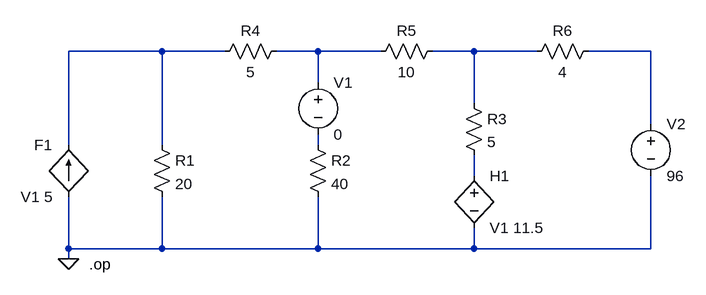
[diagram p0: schematic CH03-KP2-15.asc]
CH03-KP2-15.asc, the LTspice schematic file:
Version 4
SHEET 1 880 680
WIRE -16 208 -160 208
WIRE 80 208 -16 208
WIRE 224 208 160 208
WIRE 320 208 224 208
WIRE 464 208 400 208
WIRE 560 208 464 208
WIRE 736 208 640 208
WIRE 224 256 224 208
WIRE 464 288 464 208
WIRE 736 320 736 208
WIRE -160 352 -160 208
WIRE -16 352 -16 208
WIRE 224 352 224 336
WIRE 464 400 464 368
WIRE -160 512 -160 432
WIRE -16 512 -16 432
WIRE -16 512 -160 512
WIRE 224 512 224 432
WIRE 224 512 -16 512
WIRE 464 512 464 480
WIRE 464 512 224 512
WIRE 736 512 736 400
WIRE 736 512 464 512
WIRE -160 528 -160 512
FLAG -160 528 0
DATAFLAG -16 208 "$"
DATAFLAG 224 208 "$"
DATAFLAG 464 208 "$"
SYMBOL res -32 336 R0
SYMATTR InstName R1
SYMATTR Value 20
SYMBOL res 208 336 R0
SYMATTR InstName R2
SYMATTR Value 40
SYMBOL res 448 272 R0
SYMATTR InstName R3
SYMATTR Value 5
SYMBOL res 176 192 R90
WINDOW 0 0 56 VBottom 2
WINDOW 3 32 56 VTop 2
SYMATTR InstName R4
SYMATTR Value 5
SYMBOL res 416 192 R90
WINDOW 0 0 56 VBottom 2
WINDOW 3 32 56 VTop 2
SYMATTR InstName R5
SYMATTR Value 10
SYMBOL res 656 192 R90
WINDOW 0 0 56 VBottom 2
WINDOW 3 32 56 VTop 2
SYMATTR InstName R6
SYMATTR Value 4
SYMBOL voltage 224 240 R0
SYMATTR InstName V1
SYMATTR Value 0
SYMBOL voltage 736 304 R0
SYMATTR InstName V2
SYMATTR Value 96
SYMBOL f -160 432 R180
WINDOW 0 24 80 Left 2
WINDOW 3 24 0 Left 2
SYMATTR InstName F1
SYMATTR Value V1 5
SYMBOL h 464 384 R0
SYMATTR InstName H1
SYMATTR Value V1 11.5
TEXT -128 536 Left 2 !.op

The netlist it stands for:
* CH03-KP2-15.asc
R1 N001 0 20
R2 N005 0 40
R3 N003 N006 5
R4 N002 N001 5
R5 N003 N002 10
R6 N004 N003 4
V1 N002 N005 0
V2 N004 0 96
F1 0 N001 V1 5
H1 N006 0 V1 11.5
.op
.backanno
.end